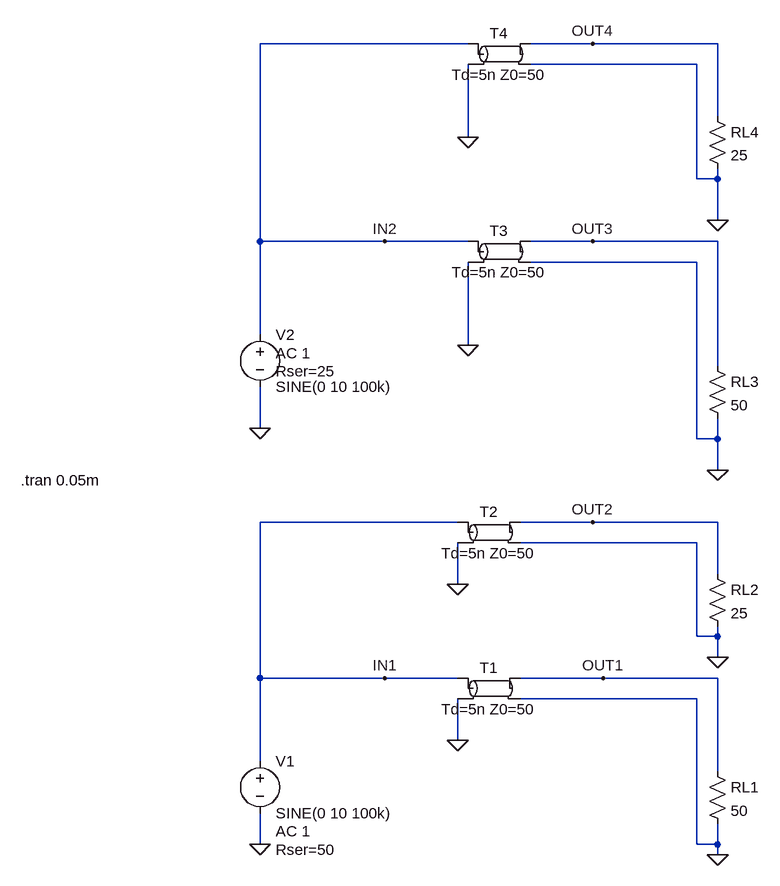
[diagram p0: schematic Lossless.asc]
Lossless.asc, the LTspice schematic file:
Version 4
SHEET 1 1764 680
WIRE 1312 -1024 992 -1024
WIRE 1504 -1024 1408 -1024
WIRE 1696 -1024 1504 -1024
WIRE 1664 -992 1408 -992
WIRE 1696 -912 1696 -1024
WIRE 1312 -880 1312 -992
WIRE 1664 -816 1664 -992
WIRE 1696 -816 1696 -832
WIRE 1696 -816 1664 -816
WIRE 1696 -752 1696 -816
WIRE 992 -720 992 -1024
WIRE 1184 -720 992 -720
WIRE 1312 -720 1184 -720
WIRE 1504 -720 1408 -720
WIRE 1696 -720 1504 -720
WIRE 1664 -688 1408 -688
WIRE 992 -576 992 -720
WIRE 1312 -560 1312 -688
WIRE 1696 -528 1696 -720
WIRE 992 -432 992 -496
WIRE 1664 -416 1664 -688
WIRE 1696 -416 1696 -448
WIRE 1696 -416 1664 -416
WIRE 1696 -368 1696 -416
WIRE 1296 -288 992 -288
WIRE 1504 -288 1392 -288
WIRE 1696 -288 1504 -288
WIRE 1664 -256 1392 -256
WIRE 1696 -208 1696 -288
WIRE 1296 -192 1296 -256
WIRE 1664 -112 1664 -256
WIRE 1696 -112 1696 -128
WIRE 1696 -112 1664 -112
WIRE 1696 -80 1696 -112
WIRE 992 -48 992 -288
WIRE 1184 -48 992 -48
WIRE 1296 -48 1184 -48
WIRE 1520 -48 1392 -48
WIRE 1696 -48 1520 -48
WIRE 1664 -16 1392 -16
WIRE 1296 48 1296 -16
WIRE 992 80 992 -48
WIRE 1696 96 1696 -48
WIRE 992 208 992 160
WIRE 1664 208 1664 -16
WIRE 1696 208 1696 176
WIRE 1696 208 1664 208
WIRE 1696 224 1696 208
FLAG 992 208 0
FLAG 1696 -80 0
FLAG 1696 224 0
FLAG 1296 48 0
FLAG 1296 -192 0
FLAG 1312 -880 0
FLAG 1312 -560 0
FLAG 1696 -368 0
FLAG 1696 -752 0
FLAG 992 -432 0
FLAG 1184 -48 IN1
FLAG 1184 -720 IN2
FLAG 1520 -48 OUT1
FLAG 1504 -288 OUT2
FLAG 1504 -720 OUT3
FLAG 1504 -1024 OUT4
SYMBOL voltage 992 64 R0
WINDOW 123 24 124 Left 2
WINDOW 39 24 152 Left 2
SYMATTR InstName V1
SYMATTR Value SINE(0 10 100k)
SYMATTR Value2 AC 1
SYMATTR SpiceLine Rser=50
SYMBOL tline 1344 -32 R0
SYMATTR InstName T1
SYMATTR Value Td=5n Z0=50
SYMBOL tline 1344 -272 R0
SYMATTR InstName T2
SYMATTR Value Td=5n Z0=50
SYMBOL res 1680 -224 R0
SYMATTR InstName RL2
SYMATTR Value 25
SYMBOL res 1680 80 R0
SYMATTR InstName RL1
SYMATTR Value 50
SYMBOL voltage 992 -592 R0
WINDOW 123 24 44 Left 2
WINDOW 39 24 72 Left 2
SYMATTR InstName V2
SYMATTR Value SINE(0 10 100k)
SYMATTR Value2 AC 1
SYMATTR SpiceLine Rser=25
SYMBOL tline 1360 -704 R0
SYMATTR InstName T3
SYMATTR Value Td=5n Z0=50
SYMBOL tline 1360 -1008 R0
SYMATTR InstName T4
SYMATTR Value Td=5n Z0=50
SYMBOL res 1680 -928 R0
SYMATTR InstName RL4
SYMATTR Value 25
SYMBOL res 1680 -544 R0
SYMATTR InstName RL3
SYMATTR Value 50
TEXT 624 -352 Left 2 !.tran 0.05m

The netlist it stands for:
* Lossless.asc
V1 IN1 0 SINE(0 10 100k) AC 1 Rser=50
T1 IN1 0 OUT1 0 Td=5n Z0=50
T2 IN1 0 OUT2 0 Td=5n Z0=50
RL2 OUT2 0 25
RL1 OUT1 0 50
V2 IN2 0 SINE(0 10 100k) AC 1 Rser=25
T3 IN2 0 OUT3 0 Td=5n Z0=50
T4 IN2 0 OUT4 0 Td=5n Z0=50
RL4 OUT4 0 25
RL3 OUT3 0 50
.tran 0.05m
.backanno
.end